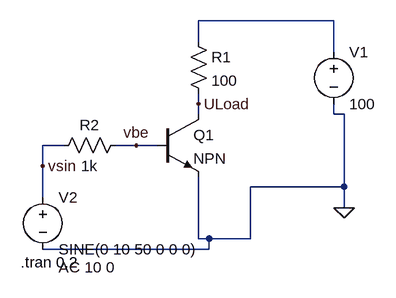
[diagram p0: schematic opamwithsininput.asc]
opamwithsininput.asc, the LTspice schematic file:
Version 4
SHEET 1 880 680
WIRE 352 -32 144 -32
WIRE 144 0 144 -32
WIRE 352 16 352 -32
WIRE 144 96 144 80
WIRE 144 112 144 96
WIRE 352 112 352 96
WIRE 368 112 352 112
WIRE -64 160 -96 160
WIRE 48 160 16 160
WIRE 80 160 48 160
WIRE -96 192 -96 160
WIRE 368 224 368 112
WIRE 368 224 224 224
WIRE -96 240 -96 192
WIRE 368 256 368 224
WIRE 144 304 144 208
WIRE 160 304 144 304
WIRE 224 304 224 224
WIRE 224 304 160 304
WIRE 160 320 160 304
WIRE 160 320 -96 320
FLAG 368 256 0
FLAG 48 160 vbe
FLAG 144 96 ULoad
FLAG -96 192 vsin
SYMBOL npn 80 112 R0
SYMATTR InstName Q1
SYMBOL res 128 -16 R0
SYMATTR InstName R1
SYMATTR Value 100
SYMBOL voltage 352 0 R0
WINDOW 123 0 0 Left 0
WINDOW 39 0 0 Left 0
SYMATTR InstName V1
SYMATTR Value 100
SYMBOL res 32 144 R90
WINDOW 0 0 56 VBottom 2
WINDOW 3 32 56 VTop 2
SYMATTR InstName R2
SYMATTR Value 1k
SYMBOL voltage -96 224 R0
WINDOW 123 24 124 Left 2
WINDOW 39 0 0 Left 0
SYMATTR InstName V2
SYMATTR Value SINE(0 10 50 0 0 0)
SYMATTR Value2 AC 10 0
TEXT -130 340 Left 2 !.tran 0.2

The netlist it stands for:
* opamwithsininput.asc
Q1 ULoad vbe 0 0 NPN
R1 N001 ULoad 100
V1 N001 0 100
R2 vbe vsin 1k
V2 vsin 0 SINE(0 10 50 0 0 0) AC 10 0
.model NPN NPN
.model PNP PNP
.lib standard.bjt
.tran 0.2
.backanno
.end